# Altium schematic sheet BCM2.SchDoc
size A4; SheetNumber: 2; SheetTotal: 5
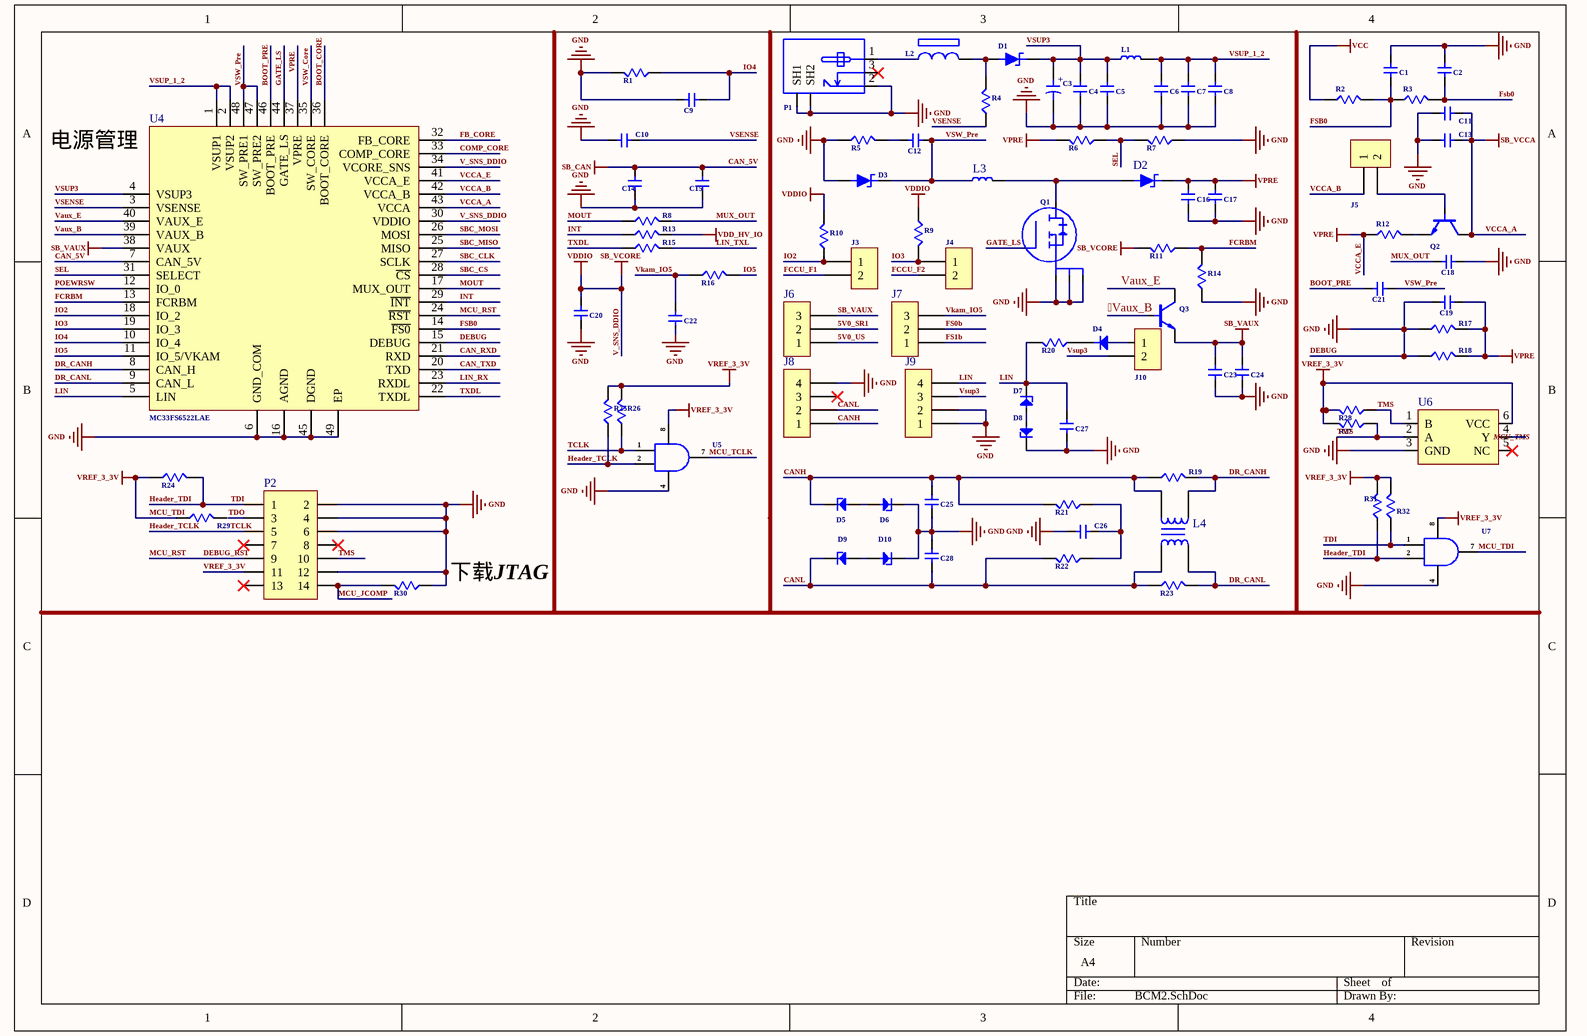
[diagram p0: BCM2.SchDoc]

## Parts
C1  CAP  (value not drawn)
C2  CAP  (value not drawn)
C3  CAP_Election  (value not drawn)
C4  CAP  (value not drawn)
C5  CAP  (value not drawn)
C6  CAP  (value not drawn)
C7  CAP  (value not drawn)
C8  CAP  (value not drawn)
C9  CAP  (value not drawn)
C10  CAP  (value not drawn)
C11  CAP  (value not drawn)
C12  CAP  (value not drawn)
C13  CAP  (value not drawn)
C14  CAP  (value not drawn)
C15  CAP  (value not drawn)
C16  CAP  (value not drawn)
C17  CAP  (value not drawn)
C18  CAP  (value not drawn)
C19  CAP  (value not drawn)
C20  CAP  (value not drawn)
C21  CAP  (value not drawn)
C22  CAP  (value not drawn)
C23  CAP  (value not drawn)
C24  CAP  (value not drawn)
C25  CAP  (value not drawn)
C26  CAP  (value not drawn)
C27  CAP  (value not drawn)
C28  CAP  (value not drawn)
D1  ZENER  (value not drawn)
D2  ZENER  (value not drawn)
D3  ZENER  (value not drawn)
D4  DIODE  (value not drawn)
D5  ZENER1  (value not drawn)
D6  ZENER1  (value not drawn)
D7  ZENER1  (value not drawn)
D8  ZENER1  (value not drawn)
D9  ZENER1  (value not drawn)
D10  ZENER1  (value not drawn)
J3  CON2  (value not drawn)
J4  CON2  (value not drawn)
J5  CON2  [DG1282-5.0]  (value not drawn)
J6  CON3  (value not drawn)
J7  CON3  (value not drawn)
J8  CON4  (value not drawn)
J9  CON4  (value not drawn)
J10  CON2  (value not drawn)
L1  L  (value not drawn)
L2  BLM18KG121TZ1  (value not drawn)
L3  L  (value not drawn)
L4  TRANS1  (value not drawn)
P1  CON_PWR  (value not drawn)
P2  DIP14  (value not drawn)
Q1  BUK9M24  (value not drawn)
Q2  NPN  [TO-92]  (value not drawn)
Q3  NPN  [TO-92]  (value not drawn)
R1  RES  (value not drawn)
R2  RES  (value not drawn)
R3  RES  (value not drawn)
R4  RES  (value not drawn)
R5  RES  (value not drawn)
R6  RES  (value not drawn)
R7  RES  (value not drawn)
R8  RES  (value not drawn)
R9  RES  (value not drawn)
R10  RES  (value not drawn)
R11  RES  (value not drawn)
R12  RES  (value not drawn)
R13  RES  (value not drawn)
R14  RES  (value not drawn)
R15  RES  (value not drawn)
R16  RES  (value not drawn)
R17  RES  (value not drawn)
R18  RES  (value not drawn)
R19  RES  (value not drawn)
R20  RES  (value not drawn)
R21  RES  (value not drawn)
R22  RES  (value not drawn)
R23  RES  (value not drawn)
R24  RES  (value not drawn)
R25  RES  (value not drawn)
R26  RES  (value not drawn)
R27  RES  (value not drawn)
R28  RES  (value not drawn)
R29  RES  (value not drawn)
R30  RES  (value not drawn)
R31  RES  (value not drawn)
R32  RES  (value not drawn)
U4  MC33FS6522LAE
U5  74LVC2G08  (value not drawn)
U6  74LVC1G08  (value not drawn)
U7  74LVC2G08  (value not drawn)

## Nets
CAN_5V: C14.1 C15.1 U4.7(CAN_5V)  [also labelled SB_CAN]
DEBUG: C1.1 C2.1 C3.2 C4.2 C5.2 C6.2 C7.2 C8.2 C9.1 C10.1 C11.2 C13.2 C14.2 C15.2 C16.2 C17.2 C18.1 C19.1 C20.2 C22.2 C23.2 C24.2 C25.1 C26.1 C27.1 C28.2 D3.1(A) D6.2(K) D8.2(K) D10.2(K) J8.4 J9.1 J9.2 P1.2 P1.5(SH1) P1.?1(SH2) P2.2 P2.4 P2.6 P2.12 Q1.1 Q1.2 Q1.3 R1.2 R5.1 R7.1 R14.1 R17.1 R18.1 R30.1 U4.6(GND_COM) U4.15(DEBUG) U4.16(AGND) U4.45(DGND) U4.49(EP) U5.4 U6.3(GND) U7.4  [also labelled GND]
MCU_TDI: P2.11 R24.1 R25.2 R26.2 R27.2 R28.2 R29.1 R31.2 R32.2 U5.8 U6.6(VCC) U7.7(Y) U7.8  [also labelled VREF_3_3V]
SB_VAUX: C23.1 C24.1 J6.3 Q3.E(e) U4.38(VAUX)
V_SNS_DDIO: C20.1 R9.1 R10.2 R11.2 U4.30(VDDIO) U4.34(VCORE_SNS)  [also labelled SB_VCORE, VDDIO]
VCC: R2.1
VCCA_A: C11.1 C13.1 Q2.C(c) U4.43(VCCA)  [also labelled SB_VCCA]
VCCA_E: C16.1 C17.1 C19.2 D2.2(K) R6.2 R12.1 R17.2 R18.2 U4.37(VPRE) U4.41(VCCA_E)  [also labelled VPRE]
VDD_HV_IO: R13.2
5V0_SR1: J6.2
5V0_US: J6.1
Vaux_B: Q3.B(b)
BOOT_CORE: U4.36(BOOT_CORE)
BOOT_PRE: C21.1 U4.46(BOOT_PRE)
CAN_RXD: U4.21(RXD)
CAN_TXD: U4.20(TXD)
CANH: C25.2 D5.2(K) J8.1 L4.3 R19.1 R21.2
CANL: C28.1 D9.2(K) J8.2 L4.1 R22.2 R23.1
COMP_CORE: U4.33(COMP_CORE)
DEBUG_RST: P2.9 U4.24(~{RST})  [also labelled MCU_RST]
DR_CANH: L4.1 R19.2 U4.8(CAN_H)
DR_CANL: L4.3 R23.2 U4.9(CAN_L)
FB_CORE: U4.32(FB_CORE)
FCCU_F1: J3.2
FCCU_F2: J4.2
FCRBM: R11.1 R14.2 U4.13(FCRBM)
FS0b: J7.2
FS1b: J7.1
Fsb0: C1.2 C2.2 R2.2 R3.1 R3.2 U4.14(~{FS0})
GATE_LS: Q1.5 U4.44(GATE_LS)
Header_TCLK: P2.5 R25.1 R26.1 U5.1(A) U5.2(B)  [also labelled TCLK]
Header_TDI: P2.1 R24.2 R31.1 R32.1 U7.1(A) U7.2(B)  [also labelled TDI]
INT: R13.1 U4.29(~{INT})
IO2: J3.1 R10.1 U4.18(IO_2)
IO3: J4.1 R9.2 U4.19(IO_3)
IO4: C9.2 R1.1 U4.10(IO_4)
IO5: R16.2 U4.11(IO_5/VKAM)
LIN: C27.2 D7.2(K) J9.4 R20.2 U4.5(LIN)
LIN_RX: U4.23(RXDL)
LIN_TXL: R15.2
MCU_JCOMP: P2.14 R30.2
MCU_TCLK: U5.7(Y)
MCU_TMS: U6.4(Y)
MOUT: R8.1 U4.17(MUX_OUT)
MUX_OUT: C18.2 R8.2
POEWRSW: U4.12(IO_0)
SBC_CLK: U4.27(SCLK)
SBC_CS: U4.28(~{CS})
SBC_MISO: U4.25(MISO)
SBC_MOSI: U4.26(MOSI)
SEL: R6.1 R7.2 U4.31(SELECT)
TDO: P2.3
TMS: P2.10 R27.1 R28.1 U6.1(B) U6.2(A)
TXDL: R15.1 U4.22(TXDL)
Vaux_B: U4.39(VAUX_B)
Vaux_E: Q3.C(c) U4.40(VAUX_E)
VCCA_B: J5.1 U4.42(VCCA_B)
Vkam_IO5: C22.1 J7.3 R16.1
VSENSE: C10.2 R4.1 U4.3(VSENSE)
VSUP3: C3.1 C4.1 C5.1 D1.2(K) J9.3 J10.2 L1.2 U4.4(VSUP3)
VSUP_1_2: C6.1 C7.1 C8.1 L1.1 U4.1(VSUP1) U4.2(VSUP2)
VSW_Core: U4.35(SW_CORE)
VSW_Pre: C12.1 C21.2 D3.2(K) L3.2 U4.47(SW_PRE2) U4.48(SW_PRE1)
NetC12_2: C12.2 R5.2
NetC26_2: C26.2 R21.1 R22.1
NetD1_1: D1.1(A) L2.1 R4.2
NetD2_1: D2.1(A) L3.1 Q1.5
NetD4_1: D4.1(A) J10.1
NetD4_2: D4.2(K) R20.1
NetD5_1: D5.1(A) D6.1(A)
NetD7_1: D7.1(A) D8.1(A)
NetD9_1: D9.1(A) D10.1(A)
NetJ5_2: J5.2 Q2.B(b)
NetL2_2: L2.2 P1.1
NetQ2_E: Q2.E(e) R12.2

Not connected (* = marked no-connect by the designer): J8 3*; P1 3*; P2 7* 8* 13*; R29 2; U6 5(NC)*

## Notes on the sheet
- (near U4) 电源管理
- (near R30) 下载JTAG
- (in symbol CAP_Election) +

## Library data of the parts
J3 J4 J10 = CON2: Connector
J6 J7 = CON3: Connector
J8 J9 = CON4: Connector